# EasyEDA Pro project ProPrj_BrainStimulator-4Channels-Prototype_2025-12-16.epro, board PCB1_2
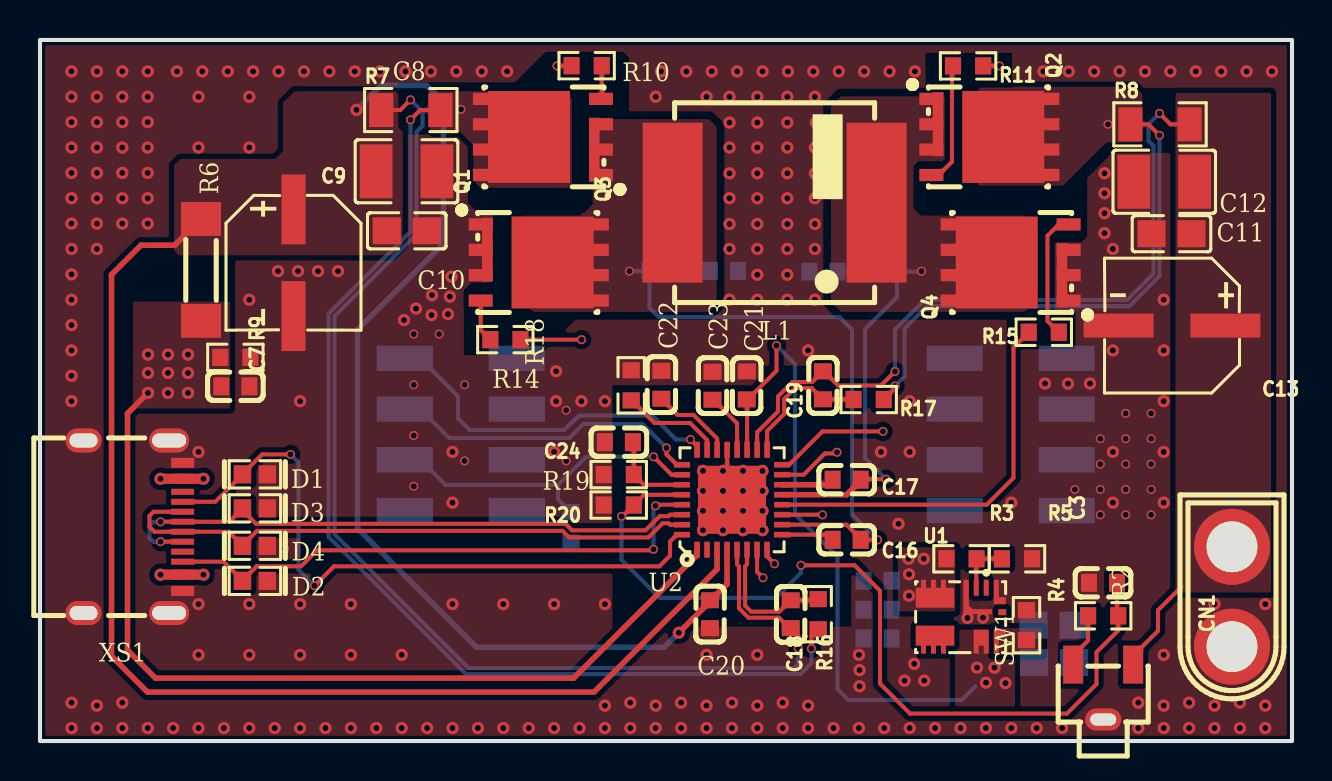
[diagram p7: board, top side]
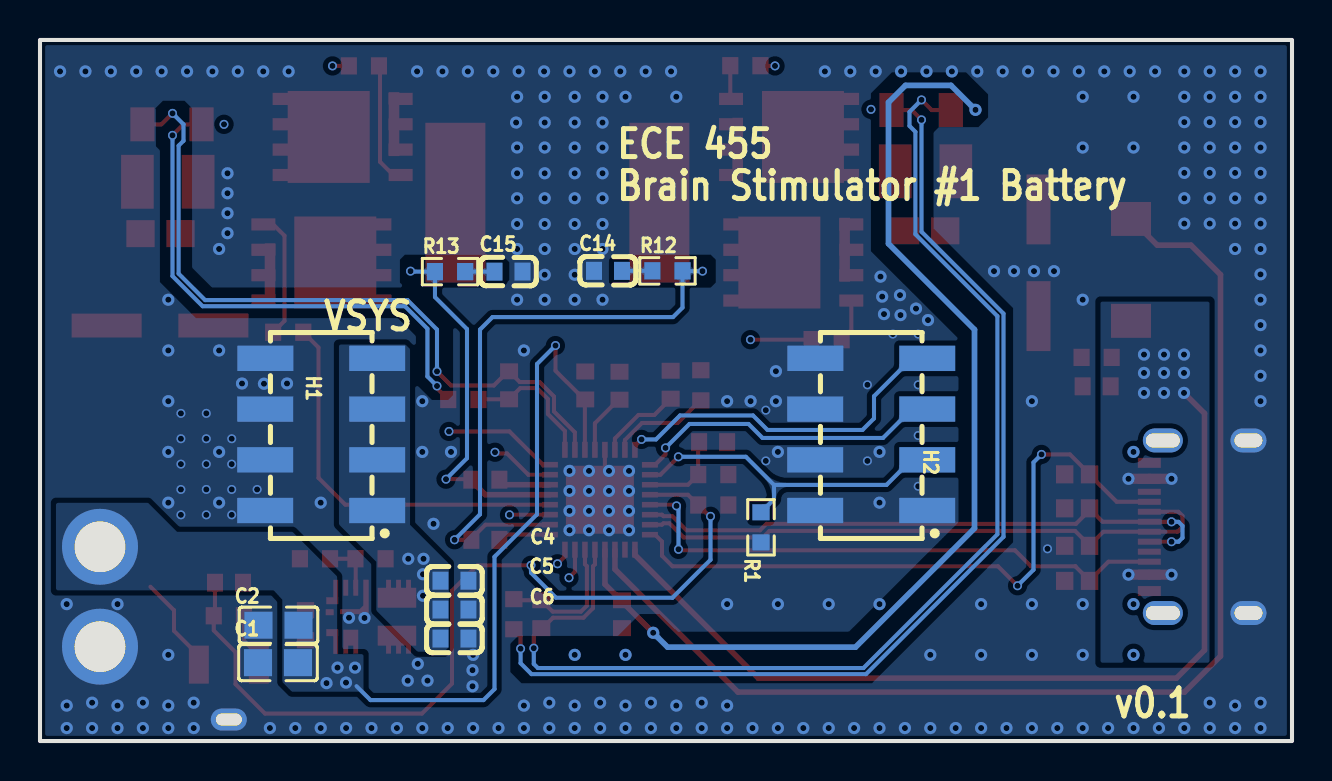
[diagram p8: board, bottom side, seen from below]

Outline 62.6 x 35.1 mm; copper layers: Top Layer, Inner1, Inner2, Bottom Layer. Coordinates in mm from the lower left corner of the outline.
Outline path: rectangle 0,35.1 62.6,0
Stack: Top Layer 0.035mm 外层铜厚1oz / Dielectric1 0.2104mm 7628 RC49% 8.6mil / Inner1 0.0152mm 内层铜厚 / Dielectric2 1.065mm 1.1mm H/HOZ 含铜 / Inner2 0.0152mm 内层铜厚 / Dielectric3 0.2104mm 7628 RC49% 8.6mil / Bottom Layer 0.035mm 外层铜厚1oz

## Design rules (mm)
net USB_DN: DP1
net USB_DP: DP1
spacing copperThickness1oz (default): track to track 0.102, other pairs 0.152 to 0.3
spacing copperThickness2oz: track to track 0.203, other pairs 0.152 to 0.3
spacing Plane_innerPlane: track to track 0.102, other pairs 0.152 to 0.3
spacing Copper_copperRegion: track to track 0.102, other pairs 0.152 to 0.3
spacing LXClearence: track to track 0.152, other pairs 0.152 to 0.3
track width copperThickness1oz (default): min 0.127, default 0.254, max 2.54
track width copperThickness2oz: min 0.203, default 0.254, max 2.54
differential pair differentialPair (default): width min 0.127, default 0.254, max 2.54; gap min 0.152, default 0.152
net VBAT uses copperRegion
net 9V uses copperRegion
['net', 'lx1'] ['NET', 'AGND'] uses LXClearence
['net', 'lx2'] ['NET', 'AGND'] uses LXClearence

## Placement (name value [footprint] x y rotation side)
C1  10uF  [C0805]  50.7 3.92 180 bottom
C2  100nF  [C0805]  50.68 5.8 180 bottom
C3  100nF  [C0603]  53.15 7.92 180 top
C4  22uF  [C0603]  41.88 8.03 0 bottom
C5  22uF  [C0603]  41.88 6.58 0 bottom
C6  22uF  [C0603]  41.88 5.13 0 bottom
C7  100nF  [C0603]  9.77 17.76 180 top
C8  22uF  [C1210]  18.33 28.52 180 top
C9  100uF  [CAP-SMD_BD6.3-L6.6-W6.6-FD]  12.67 23.94 270 top
C10  100nF  [C0805_1]  18.34 25.54 180 top
C11  100nF  [C0805_1]  56.58 25.4 0 top
C12  22uF  [C1210]  56.21 28 0 top
C13  100uF  [CAP-SMD_BD6.3-L6.6-W6.6-FD]  56.6 20.8 180 top
C14  3.3nF/NC  [C0603_1]  34.2 23.54 180 bottom
C15  3.3nF/NC  [C0603_1]  39.18 23.5 180 bottom
C16  100nF  [C0603]  40.33 10.08 0 top
C17  100nF  [C0603]  40.33 13.08 0 top
C18  1uF  [C0603_1]  37.54 6.35 90 top
C19  1uF  [C0603_1]  39.15 17.81 90 top
C20  2.2uF  [C0603_1]  33.5 6.35 270 top
C21  2.2uF  [C0603_1]  35.34 17.8 90 top
C22  2.2uF  [C0603_1]  31.07 17.84 270 top
C23  2.2uF  [C0603_1]  33.62 17.79 270 top
C24  100nF  [C0603]  28.94 14.96 0 top
CN1  XT30U-M  [CONN-TH_XT30U-M]  59.6 7.22 270 top
D1  ESDPSA0603V05  [D0603-BI]  10.74 13.35 0 top
D2  ESDPSA0603V05  [D0603-BI]  10.74 8.02 0 top
D3  ESDPSA0603V05  [D0603-BI]  10.74 11.65 0 top
D4  ESDPSA0603V05  [D0603-BI]  10.74 9.77 0 top
H1  2.54-2*4P立贴针  [HDR-SMD_8P-P2.54-V-M-R2-C4-LS7.4]  48.54 15.35 90 bottom
H2  2.54-2*4P立贴针  [HDR-SMD_8P-P2.54-V-M-R2-C4-LS7.4]  21.04 15.35 90 bottom
L1  4.7uH  [IND-SMD_L10.9-W10.0]  36.73 26.95 0 top
Q1  BSC059N04LS6  [TDSON-8_L6.0-W5.0-P1.27-LS6.2-BL]  25.2 30.24 90 top
Q2  BSC059N04LS6  [TDSON-8_L6.0-W5.0-P1.27-LS6.2-BL]  47.42 30.24 270 top
Q3  BSC059N04LS6  [TDSON-8_L6.0-W5.0-P1.27-LS6.2-BL]  24.89 23.96 270 top
Q4  BSC059N04LS6  [TDSON-8_L6.0-W5.0-P1.27-LS6.2-BL]  48.58 23.96 90 top
R1  510K  [R0603]  26.55 10.7 90 bottom
R2  43kΩ  [R0603_1]  53.16 6.27 180 top
R3  140kΩ  [R0603]  46.08 9.12 180 top
R4  18kΩ  [R0603]  49.33 5.8 270 top
R5  10kΩ  [R0603]  48.85 9.12 180 top
R6  0Ω  [RES-SMD_L5.2-W1.5]  8.05 23.59 90 top
R7  5mΩ  [R1206]  18.54 31.59 0 top
R8  5mΩ  [R1206]  56 30.88 0 top
R9  10kΩ  [R0603]  9.77 19.21 180 top
R10  0Ω  [R0603_1]  27.33 33.81 0 top
R11  0Ω  [R0603_1]  46.41 33.8 180 top
R12  2Ω/NC  [R0603_1]  31.23 23.54 180 bottom
R13  2Ω/NC  [R0603_1]  42.1 23.5 180 bottom
R14  0Ω  [R0603_1]  23.27 20.09 180 top
R15  0Ω  [R0603_1]  50.19 20.46 0 top
R16  10Ω  [R0603_1]  38.91 6.35 90 top
R17  10Ω  [R0603_1]  41.43 17.1 180 top
R18  9.1kΩ  [R0603_1]  29.56 17.81 270 top
R19  ERTJ1VG103FA  [R0603_1]  28.94 13.34 0 top
R20  10kΩ  [R0603]  28.94 11.82 180 top
SW1  TS-1091C-A3B3-D2  [SW-SMD_YUANDI_TS-1091C-A3B3-D2]  53.16 2.45 0 top
U1  TPSM84338RCJR  [QFN-FCMOD-9_L4.5-W3.3_TPSM84338]  46.43 6.32 270 top
U2  IP2363  [QFN-32_L5.0-W5.0-P0.50-BL-EP3.4]  34.6 12.08 0 top
XS1  U263-163N-4OS1735  [USB-C-SMD_U263-163N-4GS1735_1]  4.65 10.73 270 top

## Footprints (pads in the part's own frame, mm; a bottom-side part is the same pattern mirrored in y, then rotated)
C0603
  rect 0.8x0.9 smd: 1(-0.7,0) 2(0.7,0)
C0603_1
  rect 0.8x0.9 smd: 1(-0.7,0) 2(0.7,0)
C0805
  rect 1.41x1.35 smd: 1(-1,0) 2(1,0)
C0805_1
  rect 1.41x1.35 smd: 1(-1,0) 2(1,0)
C1210
  rect 1.635x2.7 smd: 1(-1.518,0) 2(1.518,0)
CAP-SMD_BD6.3-L6.6-W6.6-FD
  rect 3.5x1.2 smd: 1(-2.67,0) 2(2.67,0)
CONN-TH_XT30U-M
  round 3.8 hole 2.54: 1(-2.5,0) 2(2.5,0)
D0603-BI
  rect 0.873x0.907 smd: 1(-0.622,0) 2(0.622,0)
HDR-SMD_8P-P2.54-V-M-R2-C4-LS7.4
  rect 1.27x2.8 smd: 1(-3.81,-2.8) 2(-3.81,2.8) 3(-1.27,-2.8) 4(-1.27,2.8) 5(1.27,-2.8) 6(1.27,2.8) 7(3.81,-2.8) 8(3.81,2.794)
IND-SMD_L10.9-W10.0
  rect 3x8 smd: 1(-5.1,0) 2(5.1,0)
QFN-32_L5.0-W5.0-P0.50-BL-EP3.4
  rect 0.28x0.8 smd: 1(-1.75,-2.5) 2(-1.252,-2.5) 3(-0.751,-2.5) 4(-0.252,-2.5) 5(0.248,-2.5) 6(0.749,-2.5) 7(1.248,-2.5) 8(1.748,-2.5) 17(1.752,2.5) 18(1.252,2.5) 19(0.751,2.5) 20(0.252,2.5) 21(-0.248,2.5) 22(-0.749,2.5) 23(-1.248,2.5) 24(-1.748,2.5)
  rect 0.8x0.28 smd: 9(2.5,-1.748) 10(2.5,-1.248) 11(2.5,-0.748) 12(2.5,-0.248) 13(2.5,0.252) 14(2.5,0.752) 15(2.5,1.252) 16(2.5,1.752) 25(-2.5,1.75) 26(-2.5,1.25) 27(-2.5,0.75) 28(-2.5,0.25) 29(-2.5,-0.25) 30(-2.5,-0.75) 31(-2.5,-1.25) 32(-2.5,-1.75)
  rect 3.4x3.4 smd: 33(0,0)
QFN-FCMOD-9_L4.5-W3.3_TPSM84338
  rect 0.8x0.25 smd: 1(-1.35,0.881) 2(-1.35,0.382)
  custom 1.725x1.431 smd: 3(-0.887,0.448)
  custom 1.4x1.925 smd: 4(-1.05,-1.681) 5(1.25,-1.681)
  custom 1.2x0.75 smd: 6(1.35,0.631)
  custom 1.236x0.6 smd: 7(1.343,1.556)
  rect 0.3x0.4 smd: 8(-0.125,1.681)
  custom 1.225x0.6 smd: 9(-1.137,1.556)
R0603
  rect 0.806x0.864 smd: 1(-0.753,0) 2(0.753,0)
R0603_1
  rect 0.806x0.864 smd: 1(-0.753,0) 2(0.753,0)
R1206
  rect 1.208x1.701 smd: 1(-1.479,0) 2(1.479,0)
RES-SMD_L5.2-W1.5
  rect 1.7x2 smd: 1(-2.55,0) 2(2.55,0)
SW-SMD_YUANDI_TS-1091C-A3B3-D2
  rect 1x1.9 smd: 1(-1.5,1.375) 2(1.5,1.375)
  oval 1.8x1.1 hole 1.3x0.6: 3(0,-1.375)
TDSON-8_L6.0-W5.0-P1.27-LS6.2-BL
  rect 0.61x1.2 smd: 1(-1.905,-2.852) 2(-0.635,-2.852) 3(0.635,-2.852) 4(1.905,-2.852)
  rect 3.2x0.53 smd: 3(-0.64,-2.519)
  rect 0.61x1.397 smd: 5(1.905,2.852) 6(0.635,2.852) 7(-0.635,2.852) 8(-1.905,2.852)
  rect 4.6x4.1 smd: 9(0,0.744)
USB-C-SMD_U263-163N-4GS1735_1
  rect 0.5x1.15 smd: A1B12(-3.2,2.478) A4B9(-2.4,2.478) A9B4(2.4,2.478) A12B1(3.219,2.478)
  rect 0.3x1.15 smd: A5(-1.25,2.478) A6(-0.25,2.478) A7(0.25,2.478) A8(1.25,2.478) B5(1.75,2.478) B6(0.75,2.478) B7(-0.75,2.478) B8(-1.75,2.478)
  oval 1.2x2 hole 0.7x1.7: SH1(-4.32,1.802) SH1(4.32,1.802)
  oval 1.2x1.8 hole 0.7x1.4: SH1(-4.32,-2.478) SH1(4.32,-2.478)

## Nets
As in the schematic.

Pads without a net: U1 1 5 8; XS1 A8 B8

## Via types
v1: diameter 0.45, hole 0.305, Top Layer to Bottom Layer, 59 vias
v2: diameter 0.61, hole 0.305, Top Layer to Bottom Layer, 283 vias

## Routing (per net, layer and track width the routed paths; a pad name or vN(x,y) marks a point on that pad's centre or on a via; arc(x,y) is an arc through that point)
9V:
  vias: v2(43.43,9.12) v2(43.45,8.35) v2(43.45,7.27) v2(44.19,9.12)
AGND: length 1.1
  Top Layer w0.203: v2(34.15,13.52) 34.36,13.73 34.36,14.58
  vias: v1(12.23,9.62) v1(18.69,20.38) v1(18.69,17.83) v1(18.69,15.29) v1(18.69,12.75) v1(19.96,20.38) v1(21.23,17.83) v1(21.23,14.02) v1(26.31,16.56) v1(26.31,14.02) v1(51.75,12.59) v1(53.02,15.13) v1(53.02,13.86) v1(53.02,12.59) v1(53.02,11.32) v1(54.28,16.41) v1(54.28,15.13) v1(54.28,13.86) v1(54.28,12.59) v1(54.28,11.32) v1(55.56,16.41) v1(55.56,15.13) v1(55.56,13.86) v1(55.56,12.59) v1(55.56,11.32) v2(1.58,33.52) v2(1.58,32.25) v2(1.58,30.98) v2(1.58,29.71) v2(1.58,28.44) v2(1.58,27.17) v2(1.58,25.91) v2(1.58,24.63) v2(1.58,23.36) v2(1.58,22.09) v2(1.58,20.82) v2(1.58,19.55) v2(1.58,18.28) v2(1.58,17.02) v2(1.58,1.92) v2(1.58,0.65) v2(2.84,33.52) v2(2.84,32.25) v2(2.84,30.98) v2(2.84,29.71) v2(2.84,28.44) v2(2.84,27.17) v2(2.84,25.91) v2(2.84,24.63) v2(2.84,1.77) v2(2.84,0.65) v2(4.12,33.52) v2(4.12,32.25) v2(4.12,30.98) v2(4.12,29.71) v2(4.12,28.44) v2(4.12,27.17) v2(4.12,25.91) v2(4.12,1.92) v2(4.12,0.65) v2(5.39,33.52) v2(5.39,32.25) v2(5.39,30.98) v2(5.39,29.71) v2(5.39,28.44) v2(5.39,27.17) v2(5.39,25.91) v2(5.39,0.65) v2(6.66,0.65) v2(6.85,33.52) v2(7.93,32.25) v2(7.93,29.71) v2(7.93,14.47) v2(7.93,6.85) v2(7.93,4.31) v2(7.93,0.65) v2(8.12,33.52) v2(9.2,0.65) v2(9.39,33.52) v2(10.47,32.25) v2(10.47,29.71) v2(10.47,22.09) v2(10.47,6.85) v2(10.47,4.31) v2(10.47,0.65) v2(10.66,33.52) v2(11.73,0.65) v2(11.93,33.52) v2(11.9,23.52) v2(12.9,23.52) v2(13.01,17.02) v2(13.01,6.85) v2(13.01,4.31) v2(13.01,0.65) v2(13.2,33.52) v2(13.9,23.52) v2(14.28,0.65) v2(14.47,33.52) v2(14.9,23.52) v2(15.55,6.85) v2(15.55,4.31) v2(15.55,0.65) v2(15.74,33.52) v2(16.81,0.65) v2(17.01,33.52) v2(18.09,4.31) v2(18.09,0.65) v2(18.2,21.07) v2(18.28,33.52) v2(18.8,21.65) v2(19.36,0.65) v2(19.55,33.52) v2(19.6,22.32) v2(19.58,21.32) v2(20.4,21.37) v2(20.49,22.25) v2(20.58,23.25) v2(20.62,14.47) v2(20.62,11.93) v2(20.62,6.85) v2(20.62,0.65) v2(20.82,33.52) v2(21.9,0.65) v2(22.09,33.52) v2(23.16,6.85) v2(23.16,0.65) v2(23.36,33.52) v2(24.44,0.65) v2(25.71,14.47) v2(25.71,6.85) v2(25.71,0.65) v2(25.81,18.52) v2(25.81,17.02) v2(26.97,0.65) v2(27.07,17.02) v2(28.25,17.02) v2(28.25,6.85) v2(28.25,1.77) v2(28.25,0.65) v2(29.52,1.92) v2(29.52,0.65) v2(30.78,32.25) v2(30.78,1.77) v2(30.78,0.65) v2(31.05,33.52) v2(32.06,1.92) v2(32.06,0.65) v2(32.32,33.52) v2(33.15,13.52) v2(33.15,12.52) v2(33.15,11.52) v2(33.15,10.56) v2(33.33,32.25) v2(33.33,4.31) v2(33.33,1.77) v2(33.33,0.65) v2(33.59,33.52) v2(34.15,12.52) v2(34.15,11.52) v2(34.15,10.56) v2(34.47,32.25) v2(34.47,30.96) v2(34.47,29.71) v2(34.47,28.42) v2(34.47,27.17) v2(34.47,25.88) v2(34.47,24.63) v2(34.47,22.09) v2(34.59,1.92) v2(34.59,0.65) v2(34.86,33.52) v2(35.15,13.52) v2(35.15,12.52) v2(35.15,11.52) v2(35.15,10.56) v2(35.87,32.25) v2(35.87,30.96) v2(35.87,29.71) v2(35.87,28.42) v2(35.87,27.17) v2(35.87,25.88) v2(35.87,24.63) v2(35.87,23.34) v2(35.87,22.09) v2(35.87,4.31) v2(35.87,1.77) v2(35.87,0.65) v2(36.13,33.52) v2(36.12,13.52) v2(36.12,12.52) v2(36.12,11.52) v2(36.12,10.56) v2(37.14,1.92) v2(37.14,0.65) v2(37.4,33.52) v2(37.37,32.25) v2(37.37,30.96) v2(37.37,29.71) v2(37.37,28.42) v2(37.37,27.17) v2(37.37,25.88) v2(37.37,24.63) v2(37.37,23.34) v2(37.37,22.09) v2(38.41,19.55) v2(38.41,1.77) v2(38.41,0.65) v2(38.67,33.52) v2(38.75,32.25) v2(38.75,29.71) v2(38.75,28.42) v2(38.75,27.17) v2(38.75,25.88) v2(38.75,24.63) v2(38.75,22.09) v2(38.8,30.96) v2(39.68,0.65) v2(39.94,33.52) v2(40.94,4.31) v2(40.94,0.65) v2(40.97,3.55) v2(40.97,2.74) v2(41.21,33.52) v2(42.05,14.47) v2(42.22,0.65) v2(42.48,33.52) v2(42.93,10.88) v2(43.22,3.02) v2(43.49,17.02) v2(43.49,14.47) v2(43.49,0.65) v2(43.75,33.52) v2(43.71,3.86) v2(44.21,3.02) v2(44.75,0.65) v2(46.03,0.65) v2(46.37,6.16) v2(47.15,6.17) v2(47.3,0.65) v2(48.56,11.93) v2(48.56,0.65) v2(49.84,0.65) v2(50.17,33.52) v2(50.25,17.9) v2(51.11,0.65) v2(51.44,33.52) v2(51.4,17.89) v2(52.5,17.9) v2(52.71,33.52) v2(53.22,28.42) v2(53.22,27.42) v2(53.22,26.42) v2(53.22,25.42) v2(53.65,24.63) v2(53.65,19.55) v2(53.65,14.47) v2(53.65,11.93) v2(53.98,33.52) v2(54.91,1.92) v2(54.91,0.65) v2(55.25,33.52) v2(56.19,22.09) v2(56.19,19.55) v2(56.19,17.02) v2(56.19,14.47) v2(56.19,11.93) v2(56.19,4.31) v2(56.19,1.77) v2(56.19,0.65) v2(56.52,33.52) v2(57.46,1.92) v2(57.46,0.65) v2(57.79,33.52) v2(58.72,6.85) v2(58.72,1.77) v2(58.72,0.65) v2(59.06,33.52) v2(60,1.92) v2(60,0.65) v2(60.33,33.52) v2(61.27,6.85) v2(61.27,1.77) v2(61.27,0.65) v2(61.6,33.52)
VBAT: length 73
  Top Layer w0.203: 35.86,14.58 35.86,15.45 36.9,16.5 36.9,17.25 37.62,17.97 38.61,17.97 C19.2 39.2,18.51 39.91,17.8 42.05,17.8 v1(42.75,18.5) ; 57.08,7.72 55.9,6.55 55.9,5.52 54.66,4.28 SW1.2 ; v1(55.97,31.42) 56.53,30.88 R8.2 ; v1(36.83,19.8) 36.83,18.54 35.39,17.1 C21.1 35.36,17.09 35.36,14.58
  Bottom Layer w0.203: v1(36.83,19.8) 37.75,18.88 37.75,11.35 39.88,9.22 39.88,2.6 40.43,2.05 46.08,2.05 46.78,2.75 ; v1(42.75,18.5) 42.75,20.6 44.22,22.07 54.34,22.07 55.67,23.4 55.67,29.8 55.43,30.05 55.43,30.88 v1(55.97,31.42)
  vias: v2(46.85,3.67) v2(47.3,2.92) v2(47.72,3.67) v2(48.28,2.9)
VBUS_C: length 49.5
  Top Layer w0.279: v2(5.4,17.43) 4.38,16.4 4.38,4.55 5.78,3.15 26.68,3.15 32.85,9.32 U2.1
  Top Layer w0.508: v2(8.18,8.33) XS1.A9B4 v2(6.03,8.33) ; v2(6.03,13.13) XS1.A4B9 v2(8.18,13.13)
  vias: v2(5.4,19.35) v2(5.4,18.43) v2(6.4,19.35) v2(6.4,18.43) v2(6.4,17.43) v2(7.4,19.35) v2(7.4,18.43) v2(7.4,17.43)
VBUS_IN: length 171.1
  Top Layer w0.203: v1(37.91,4.65) 37.91,5.27 C18.1 37.47,5.65 36.95,6.17 35.43,6.17 34.95,6.65 34.95,8.75 34.85,8.85 U2.5 ; R7.1 18.02,31.59 v1(18.53,32.1)
  Top Layer w0.279: U2.3 33.85,8.6 27.7,2.45 5.38,2.45 3.58,4.25 3.58,23.35 5.05,24.82 6.74,24.82 R6.2 ; v2(31.94,5.42) 33.5,6.98 C20.1 33.55,7.05 34.35,7.85 U2.4
  Bottom Layer w0.203: v1(37.91,4.65) 37.91,3.86 37.71,3.66 21.43,3.66 14.73,10.35 14.73,21.27 18.83,25.37 18.83,30.5 19.12,30.79 19.12,31.5 v1(18.53,32.1)
  Bottom Layer w0.279: v2(15.83,31.6) 17.05,32.82 19.33,32.82 20.18,31.97 20.18,24.9 15.88,20.6 15.88,10.65 21.83,4.7 31.22,4.7 v2(31.94,5.42)
VCC5V: length 3
  Top Layer w0.203: 34.86,14.58 34.86,15.91 33.67,17.09 C23.2
VCCIO: length 4.2
  Top Layer w0.203: 33.86,14.58 33.86,15.14 32.68,16.32 31.88,16.32 C22.2
BAT_NUM: length 5.1
  Top Layer w0.203: 33.36,14.58 33.36,15.07 32.5,15.92 30.72,15.92 29.59,17.06 R18.2
BST1: length 2.6
  Top Layer w0.203: 37.1,10.33 39.38,10.33 C16.1
BST2: length 2.6
  Top Layer w0.279: 37.1,12.83 39.38,12.83 C17.1
CC1: length 33.3
  Top Layer w0.203: v1(12.53,14.35) 11.1,14.35 10.12,13.37 D1.1 10.12,13.34 8.77,11.98 XS1.A5 ; v1(13.73,7.77) 14.7,8.75 30.97,8.75 31.5,9.28 31.5,9.99 31.84,10.33 U2.32
  Bottom Layer w0.203: v1(12.53,14.35) 12.93,13.95 12.93,8.57 v1(13.73,7.77)
CC2: length 28.2
  Top Layer w0.203: v1(30.78,11.77) 30.83,11.83 U2.29 ; 10.12,8.04 10.84,8.75 ; 10.12,8.04 9.18,8.98 XS1.B5 ; 10.12,8.04 D2.1 ; 10.84,8.75 10.83,8.75 ; 10.84,8.75 13.05,8.75 13.85,9.55 30.62,9.55 v1(30.68,9.6)
  Bottom Layer w0.203: v1(30.68,9.6) 30.68,11.67 v1(30.78,11.77)
EN: length 43
  Top Layer w0.203: C3.1 53.85,6.33 R2.1 53.91,5.54 52.83,4.45 52.83,2.85 51.35,1.38 43.5,1.38 42,2.88 42,7.52 40.72,8.8 v1(38.05,8.8) ; v1(29.08,11.25) 29.12,11.25 R20.1 30.2,12.33 U2.28
  Bottom Layer w0.203: v1(38.05,8.8) 38.05,8.42 36.8,7.17 30.97,7.17 29.08,9.07 v1(29.08,11.25)
HG1: length 36.5
  Top Layer w0.203: R10.1 26.57,33.8 v1(25.85,33.8) ; v1(36.72,8.88) 36.35,9.25 U2.8
  Inner2 w0.203: v1(25.85,33.8) 25.85,19.52 26.95,18.42 34.97,18.42 37.65,15.75 37.65,9.8 v1(36.72,8.88)
HG2: length 26.7
  Top Layer w0.203: R11.1 v1(47.97,33.8) ; 37.1,13.33 38.18,13.33 39.25,14.4 39.79,14.4 v1(39.85,14.46)
  Inner2 w0.203: v1(47.97,33.8) 47.97,25.2 39.85,17.08 v1(39.85,14.46)
LED1/I2C_INT: length 17
  Top Layer w0.203: v1(30.68,14.23) 31.58,13.33 U2.26
  Bottom Layer w0.203: R1.2 25.9,12.1 25.9,12.82 ; 25.9,12.82 27.31,14.23 v1(30.68,14.23) ; 25.9,12.82 20.28,12.82 19.02,14.08 18.24,14.08
LED2/I2C_SCL: length 17.9
  Top Layer w0.203: 32.86,14.58 32.86,14.77 v1(32.53,15.1)
  Bottom Layer w0.203: 18.24,19.16 19,19.16 20.9,17.26 20.9,16.15 21.47,15.57 26.22,15.57 26.95,16.3 30.6,16.3 31.8,15.1 v1(32.53,15.1)
LG1: length 23.7
  Top Layer w0.203: v1(39.12,11.32) 39.12,11.33 37.1,11.33 ; R14.1 v1(27.08,20.09)
  Inner2 w0.203: v1(39.12,11.32) 39.12,16.38 35.41,20.09 v1(27.08,20.09)
LG2: length 19.7
  Top Layer w0.203: R15.1 48.68,19.7 48.68,13.17 47.33,11.83 37.1,11.83
LX1: length 29.6
  Top Layer w0.203: v1(41.88,10.08) C16.2 41.03,10.13 40.33,10.83 37.1,10.83
  Bottom Layer w0.203: v1(41.88,10.08) 40.6,11.35 40.6,20.6 39.97,21.22 30.95,21.22 30.47,21.7 R12.2 30.46,23.52 v1(29.47,23.52)
LX2: length 18.3
  Top Layer w0.203: C17.2 41.06,13.11 v1(42.3,13.11)
  Top Layer w0.279: 37.1,12.33 40.33,12.33 41.03,13.03 C17.2
  Bottom Layer w0.203: v1(44.08,23.52) 44.05,23.5 R13.1 42.85,22.23 41.25,20.62 41.25,14.16 v1(42.3,13.11)
NTC: length 4.3
  Top Layer w0.203: C24.2 29.69,14.92 R19.2 30.2,12.83 U2.27
PCIN: length 92.5
  Top Layer w0.203: U2.7 35.85,8.47 v1(36.15,8.17) ; R16.1 38.57,5.26 v1(38.57,4.62) ; R7.2 19.02,31.59 v1(18.53,31.1)
  Inner2 w0.203: v1(21.05,31.62) 21.7,30.97 21.7,18.8 22.62,17.88 34.8,17.88 37.1,15.57 37.1,10.12 36.15,9.17 v1(36.15,8.17)
  Bottom Layer w0.203: v1(18.53,31.1) 18.53,25.5 14.43,21.4 14.43,10.22 21.3,3.35 38.03,3.35 38.57,3.9 v1(38.57,4.62)
PCON: length 58.7
  Top Layer w0.203: R17.1 42.75,17.66 v1(42.75,17.77) ; v1(42.15,15.5) 39.12,15.5 37.46,13.83 37.1,13.83 ; v1(55.97,30.32) 55.43,30.88 R8.1
  Inner2 w0.203: v1(53.4,30.88) 54.22,30.05 54.22,17.77 51.95,15.5 v1(42.15,15.5)
  Bottom Layer w0.203: v1(42.75,17.77) 43.23,18.25 43.23,20.65 44.35,21.77 54.47,21.77 55.97,23.27 v1(55.97,30.32)
PSET/I2C_SDA: length 15.8
  Top Layer w0.203: U2.25 31.84,13.83 31.33,14.35 v1(31.33,14.67)
  Bottom Layer w0.203: v1(31.33,14.67) 30.12,15.88 27.18,15.88 26.47,15.17 20.45,15.17 19,16.62 18.24,16.62
USB_DN: length 30.1
  Top Layer w0.203: XS1.B7 5.68,11.48 5.48,11.27 5.48,10.72 5.72,10.48 XS1.A7 9.43,10.48 10.12,9.79 ; 10.12,9.79 10.12,9.8 10.84,10.52 26.13,10.52 26.45,10.19 30.42,10.19 31.13,10.9 31.43,10.9 31.5,10.83 U2.31 ; 10.12,9.79 D4.1
USB_DP: length 30.2
  Top Layer w0.203: U2.30 31.5,11.33 31.43,11.26 30.98,11.26 30.28,10.55 26.6,10.55 26.28,10.88 10.8,10.88 10.12,11.55 10.12,11.63 ; 10.12,11.63 D3.1 ; 10.12,11.63 9.47,10.98 XS1.A6 6.03,10.98 v1(6.03,10.97) ; XS1.B6 v1(6.03,9.98)
  Bottom Layer w0.203: v1(6.03,10.97) 5.68,10.97 5.48,10.77 5.48,10.17 5.67,9.98 v1(6.03,9.98)
$1N219: length 2.7
  Top Layer w0.203: R5.2 R3.1 46.81,9.11 46.81,7.67
$1N308: length 6.8
  Top Layer w0.203: 36.36,14.58 36.36,15.52 37.21,16.37 37.21,17.12 37.75,17.67 38.59,17.67 C19.1 40.67,17.11 R17.2
$1N311: length 6.9
  Top Layer w0.203: R16.2 38.85,7.05 C18.2 36.97,6.48 35.55,6.48 35.25,6.78 35.25,8.75 35.35,8.85 U2.6
$1N313: length 1.5
  Bottom Layer w0.203: C15.1 R13.2
$1N316: length 1.5
  Bottom Layer w0.203: C14.2 R12.1
$1N319: length 6.4
  Top Layer w0.203: Q4.4 50.94,25.86 50.38,25.3 50.38,21.03 R15.2
$1N321: length 6.1
  Top Layer w0.203: Q2.4 44.94,28.34 45.6,29 45.6,33.75 R11.2
$1N323: length 2.2
  Top Layer w0.203: R14.2 22.03,20.58 Q3.4
$1N325: length 1.7
  Top Layer w0.203: R10.2 28.09,32.19 Q1.4
$1N345: length 2.8
  Top Layer w0.203: 52.41,6.27 52.41,5.03 51.66,4.28 SW1.1

## Copper pours and planes (outline as drawn; the poured copper is in the pictures)
9V on Top Layer: 42.9,9.7 45.76,9.7 45.76,6.49 42.9,6.49
9V on Bottom Layer: 47.65,19.85 47.65,10.84 45.78,8.97 45.78,6.53 43.72,4.47 42.39,4.47 42.16,4.7 42.16,8.88 44.1,10.82 44.1,19.62 44.33,19.85
AGND on Top Layer: -1.4,35.14 62.6,35.14 62.6,0.14 -1.4,0.14
AGND on Bottom Layer: -1.4,35.14 62.6,35.14 62.6,0.14 -1.4,0.14
AGND on Inner1: -1.4,35.14 62.6,35.14 62.6,0.14 -1.4,0.14
AGND on Inner2: -1.4,35.14 62.6,35.14 62.6,0.14 -1.4,0.14
VBAT on Top Layer: 45.75,5.58 48.75,5.58 48.75,1.72 45.75,1.72
VBAT on Top Layer: 56.78,32.45 61.55,32.45 61.55,7.43 56.78,7.43
VBAT on Bottom Layer: 46.43,2.47 46.43,4.35 47.74,4.35 47.74,8.24 49.97,10.47 55.75,10.47 57.2,11.92 61.8,11.92 61.8,7.55 50.92,7.55 50.48,7.07 50.48,2.95 50.01,2.47
VBUS_C on Top Layer: 4.65,22 9.5,22 9.5,16.65 4.65,16.65
VBUS_C on Bottom Layer: 4.12,22 9.58,22 9.58,3.92 4.12,3.92
VBUS_IN on Top Layer: 17.77,32.53 17.92,32.38 17.92,30.71 18.14,30.5 18.14,24.82 17.64,24.32 6.93,24.32 6.7,24.55 6.7,28.82 7.03,29.15 11.78,29.15 12.15,29.52 12.15,31.95 12.73,32.53
LX1 on Top Layer: 23.93,21.73 23.93,26.05 24.18,26.31 26.97,26.31 27.61,26.94 27.61,30.88 27.86,31.13 33.45,31.13 33.83,30.75 33.83,21.86 33.45,21.48 24.18,21.48
LX2 on Top Layer: 39.55,21.99 39.55,31.77 40.06,32.28 45.77,32.28 45.9,32.15 45.9,29.23 45.64,28.97 44.63,28.97 44.37,28.72 44.37,26.56 44.63,26.31 49.2,26.31 49.45,26.05 49.45,21.73 49.2,21.48 40.06,21.48
PCIN on Top Layer: 19.41,32.53 26.59,32.53 26.59,27.7 19.41,27.7
PCON on Top Layer: 46.9,27.82 46.9,32.6 47.06,32.76 54.75,32.76 55.12,32.39 55.12,30.05 55.05,29.97 53.32,29.97 51.05,27.7 47.03,27.7
$1N225 on Top Layer: 47.65,5.65 50.1,5.65 50.1,4.32 47.65,4.32

Small or netless copper shapes (teardrops, artwork), in the pictures only: 142 on Top Layer, 39 on Bottom Layer, 10 on Inner2

## Text on the board
Bottom Silkscreen Layer: v0.1 | ECE 455 | Brain Stimulator #1 Battery | VSYS
